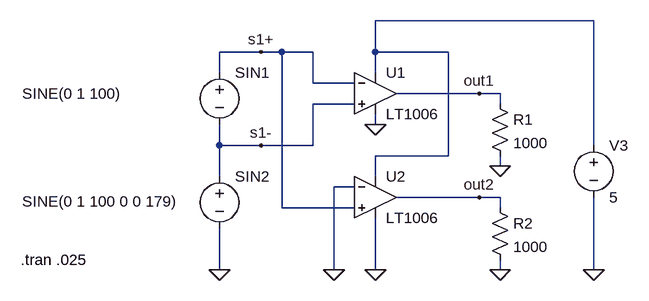
[diagram p0: schematic Draft1.asc]
Draft1.asc, the LTspice schematic file:
Version 4
SHEET 1 880 680
WIRE 496 0 160 0
WIRE -16 48 -80 48
WIRE 16 48 -16 48
WIRE 64 48 16 48
WIRE 160 48 160 0
WIRE 272 48 160 48
WIRE -80 80 -80 48
WIRE 160 80 160 48
WIRE 64 96 64 48
WIRE 128 96 64 96
WIRE 320 112 192 112
WIRE 352 112 320 112
WIRE 128 128 64 128
WIRE 352 128 352 112
WIRE 160 160 160 144
WIRE -80 192 -80 160
WIRE -16 192 -80 192
WIRE 64 192 64 128
WIRE 64 192 -16 192
WIRE 496 192 496 0
WIRE 272 208 272 48
WIRE 272 208 160 208
WIRE 352 224 352 208
WIRE -80 240 -80 192
WIRE 160 240 160 208
WIRE 128 256 96 256
WIRE 320 272 192 272
WIRE 352 272 320 272
WIRE 16 288 16 48
WIRE 128 288 16 288
WIRE 352 288 352 272
WIRE -80 384 -80 320
WIRE 96 384 96 256
WIRE 160 384 160 304
WIRE 352 384 352 368
WIRE 496 384 496 272
FLAG 160 160 0
FLAG 160 384 0
FLAG 96 384 0
FLAG -80 384 0
FLAG 352 384 0
FLAG 352 224 0
FLAG 496 384 0
FLAG -16 48 s1+
FLAG -16 192 s1-
FLAG 320 112 out1
FLAG 320 272 out2
SYMBOL Opamps\\LT1006 160 48 R0
SYMATTR InstName U1
SYMBOL Opamps\\LT1006 160 208 R0
SYMATTR InstName U2
SYMBOL voltage -80 224 R0
WINDOW 3 -304 54 Left 2
WINDOW 123 0 0 Left 2
WINDOW 39 0 0 Left 2
SYMATTR InstName SIN2
SYMATTR Value SINE(0 1 100 0 0 179)
SYMBOL voltage -80 64 R0
WINDOW 3 -304 48 Left 2
WINDOW 123 0 0 Left 2
WINDOW 39 0 0 Left 2
SYMATTR InstName SIN1
SYMATTR Value SINE(0 1 100)
SYMBOL res 336 112 R0
SYMATTR InstName R1
SYMATTR Value 1000
SYMBOL res 336 272 R0
SYMATTR InstName R2
SYMATTR Value 1000
SYMBOL voltage 496 176 R0
WINDOW 123 0 0 Left 2
WINDOW 39 0 0 Left 2
SYMATTR InstName V3
SYMATTR Value 5
TEXT -386 368 Left 2 !.tran .025

The netlist it stands for:
* Draft1.asc
XU1 s1- s1+ N001 0 out1 LT1006  ; pins In+ In- V+ V- OUT
XU2 s1+ 0 N001 0 out2 LT1006  ; pins In+ In- V+ V- OUT
V§SIN2 s1- 0 SINE(0 1 100 0 0 179)
V§SIN1 s1+ s1- SINE(0 1 100)
R1 out1 0 1000
R2 out2 0 1000
V3 N001 0 5
.tran .025
.lib LTC.lib
.backanno
.end